# Altium schematic sheet OmniSensor.SchDoc
size A4; SheetNumber: 1; SheetTotal: 1
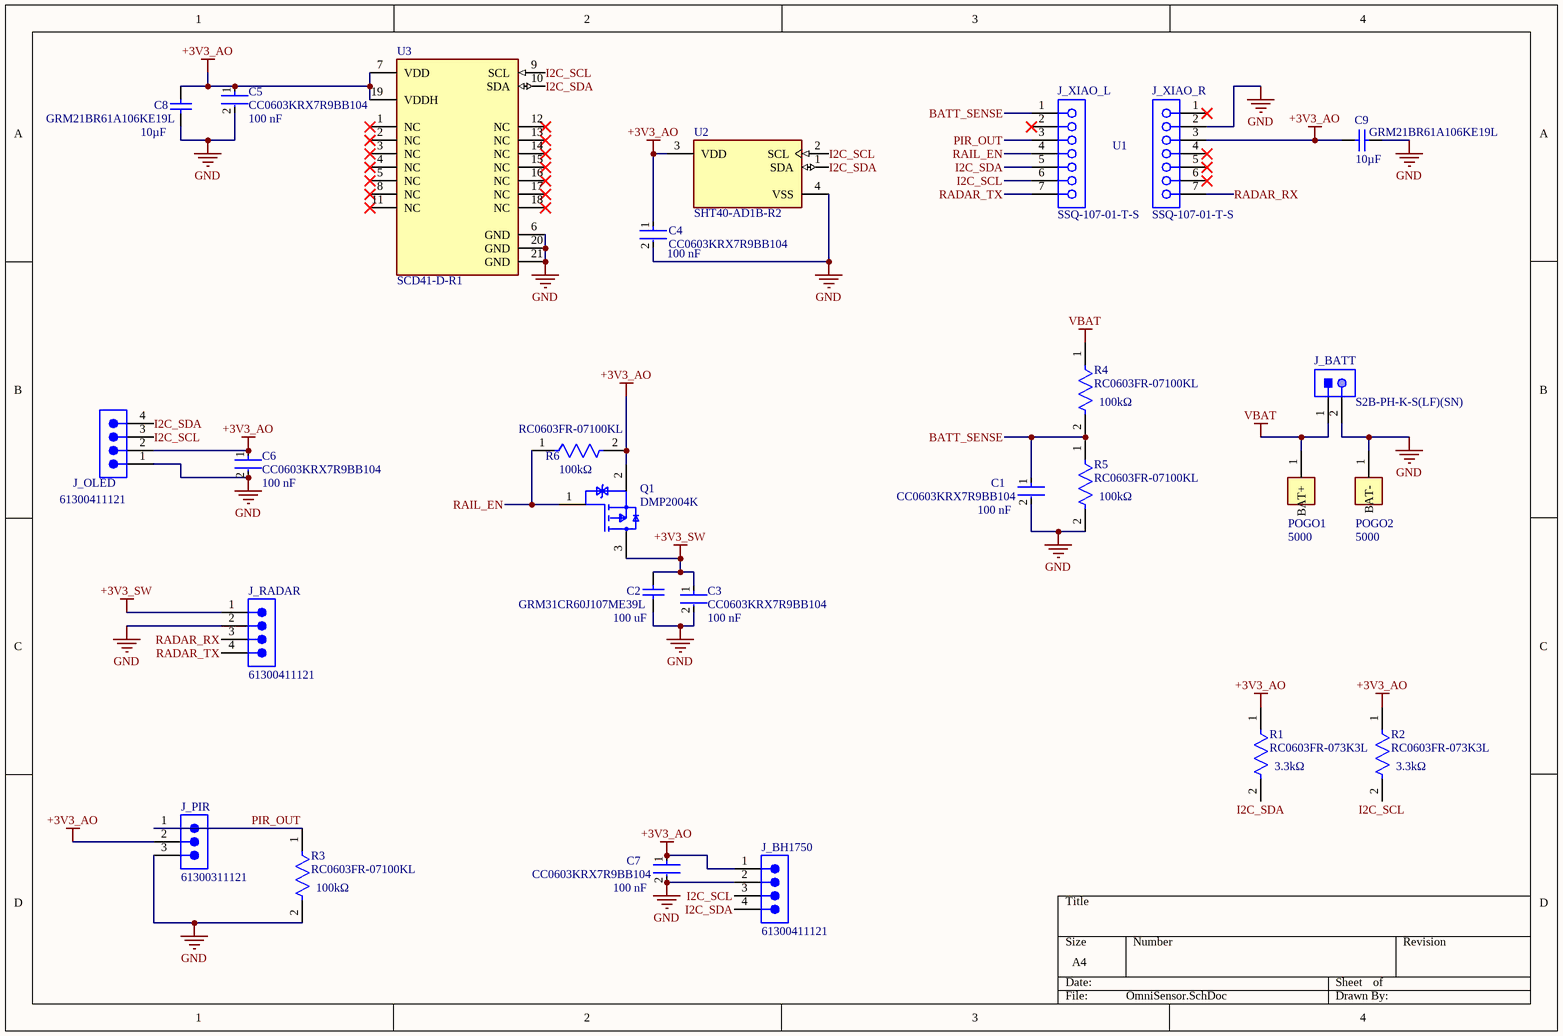
[diagram p0: OmniSensor.SchDoc]

## Parts
C1  CC0603KRX7R9BB104  value 100 nF  [FP-CC0603-DA-MFG]
C2  GRM31CR60J107ME39L  Capacitance: 100 uF  [CAPC3216X190X55ML30T25]
C3  CC0603KRX7R9BB104  value 100 nF  [FP-CC0603-DA-MFG]
C4  CC0603KRX7R9BB104  Capacitance: 100 nF  [FP-CC0603-DA-MFG]
C5  CC0603KRX7R9BB104  Capacitance: 100 nF  [FP-CC0603-DA-MFG]
C6  CC0603KRX7R9BB104  Capacitance: 100 nF  [FP-CC0603-DA-MFG]
C7  CC0603KRX7R9BB104  Capacitance: 100 nF  [FP-CC0603-DA-MFG]
C8  GRM21BR61A106KE19L  Capacitance: 10µF  [MURA-0805_H_1.35_M]
C9  GRM21BR61A106KE19L  Capacitance: 10µF  [MURA-0805_H_1.35_M]
J_BATT  S2B-PH-K-S(LF)(SN)  [JST-S2B-PH-K-S_V]
J_BH1750  61300411121  [61300411121]
J_OLED  61300411121  [61300411121]
J_PIR  61300311121  [61300311121]
J_RADAR  61300411121  [61300411121]
J_XIAO_L  SSQ-107-01-T-S  [SMTC-SSQ-107-01-X-S]
J_XIAO_R  SSQ-107-01-T-S  [SMTC-SSQ-107-01-X-S]
POGO1  5000  [FP-5000-MFG]
POGO2  5000  [FP-5000-MFG]
Q1  DMP2004K  [FP-SOT23-MFG]
R1  RC0603FR-073K3L  Resistance: 3.3kΩ  [FP-RC0603-0_55-MFG]
R2  RC0603FR-073K3L  Resistance: 3.3kΩ  [FP-RC0603-0_55-MFG]
R3  RC0603FR-07100KL  Resistance: 100kΩ  [FP-RC0603-0_55-MFG]
R4  RC0603FR-07100KL  Resistance: 100kΩ  [FP-RC0603-0_55-MFG]
R5  RC0603FR-07100KL  Resistance: 100kΩ  [FP-RC0603-0_55-MFG]
R6  RC0603FR-07100KL  Resistance: 100kΩ  [FP-RC0603-0_55-MFG]
U2  SHT40-AD1B-R2  [FP-SHT40-AD1B-R2-MFG]
U3  SCD41-D-R1  [FP-SCD41-D-R1-MFG]

## Nets
+3V3_AO: C4.1 C5.1 C6.1 C7.1 C8.2 C9.1 J_BH1750.1 J_OLED.2 J_PIR.2 J_XIAO_R.3 Q1.2(S) R1.1 R2.1 R6.2 U2.3(VDD) U3.7(VDD) U3.19(VDDH)
+3V3_SW: C2.2 C3.1 J_RADAR.1 Q1.3(D)
GND: C1.2 C2.1 C3.2 C4.2 C5.2 C6.2 C7.2 C8.1 C9.2 J_BATT.2 J_BH1750.2 J_OLED.1 J_PIR.3 J_RADAR.2 J_XIAO_R.2 POGO2.1(BAT-) R3.2 R5.2 U2.4(VSS) U3.6(GND) U3.20(GND) U3.21(GND)
VBAT: J_BATT.1 POGO1.1(BAT+) R4.1
BATT_SENSE: C1.1 J_XIAO_L.1 R4.2 R5.1
I2C_SCL: J_BH1750.3 J_OLED.3 J_XIAO_L.6 R2.2 U2.2(SCL) U3.9(SCL)
I2C_SDA: J_BH1750.4 J_OLED.4 J_XIAO_L.5 R1.2 U2.1(SDA) U3.10(SDA)
PIR_OUT: J_PIR.1 J_XIAO_L.3 R3.1
RADAR_RX: J_RADAR.3 J_XIAO_R.7
RADAR_TX: J_RADAR.4 J_XIAO_L.7
RAIL_EN: J_XIAO_L.4 Q1.1(G) R6.1

Not connected (* = marked no-connect by the designer): J_XIAO_L 2*; J_XIAO_R 1* 4* 5* 6*; U3 1(NC)* 2(NC)* 3(NC)* 4(NC)* 5(NC)* 8(NC)* 11(NC)* 12(NC)* 13(NC)* 14(NC)* 15(NC)* 16(NC)* 17(NC)* 18(NC)*

## Notes on the sheet
- U1

## Library data of the parts
C1 C3 = CMP-2100-03601-2: CAP CER 0.1UF 50V X7R 0603; Manufacturer: YAGEO; Material: Ceramic; Temperature Coefficient: 15%; Tolerance: 0.1; Description: CC0603 100 nF X7R 10.00% 50 V; Height: 0.9mm; Voltage: 50 V; ComponentLink2Description: Datasheet; Device Class L2: Capacitors; Temperature Range High: +125°C; Category: Cap; Capacitance: 100 nF; Footprint Url: http://www.yageo.com/exep/pages/download/literatures/UPY-C_GEN_24.pdf; ComponentLink2URL: http://www.yageo.com/documents/recent/UPY-GPHC_X7R_6.3V-to-50V_18.pdf; Package: CC0603-DA; Temperature: -55°C to +125°C; Voltage Rating: 50 V; Temperature Characteristic: X7R; Device Class L1: Passive Components; Temperature Range Low: -55°C; Manufacturer Part Number: CC0603KRX7R9BB104; RoHS: TRUE; Automotive: No; Device Class L3: Ceramic Capacitors; Octopart: https://octopart.com/cc0603krx7r9bb104-yageo-42244635; Mouser Description: Multilayer Ceramic Capacitor, CC Series, 0.1 - F, - 10%, X7R, 50 V, 0603 [1608 Metric]; Lead Free: Yes; Digikey Description: CAP CER 0.1UF 50V X7R 0603
C2 = CMP-1662-00011-2: Chip Capacitor, 100 uF, +/- 20%, 6.3 V, -55 to 85 degC, 1206 (3216 Metric), RoHS, Tape and Reel; Case\/Package: 1206; Voltage Rating (DC): 6.3 V; Type (Capacitors): X5R; REACH SVHC: No SVHC; Height: 1.6 mm; Tolerance: 20%; Packaging: Tape and Reel; Mount: Surface Mount; PackageDescription: 2-Pin Surface Mount Device, Body 3.2 x 1.6 mm; ComponentLink1URL: http://www.murata.com/; Pins: 2; ComponentLink2Description: Datasheet; PackageReference: 1206; Width: 1.6 mm; Package Quantity: 2000; Min Operating Temperature: -55 degC; Case Code (Imperial): 1206; Max Operating Temperature: 85 degC; DatasheetVersion: 09/2016; Mounting Technology: Surface Mount; Voltage Rating: 6.3 V; ComponentLink1Description: Manufacturer URL; Radiation Hardening: No; Case Code (Metric): 3216; PartNumber: GRM31CR60J107ME39L; Length: 3.2 mm; ComponentLink2URL: http://psearch.en.murata.com/capacitor/product/GRM31CR60J107ME39%23.pdf; RoHSCompliant: true
C4-C7 = CMP-2100-03601-2: CAP CER 0.1UF 50V X7R 0603; Manufacturer: YAGEO; Material: Ceramic; Temperature Coefficient: 15%; Tolerance: 0.1; Value: 100 nF; Description: CC0603 100 nF X7R 10.00% 50 V; Height: 0.9mm; Voltage: 50 V; ComponentLink2Description: Datasheet; Device Class L2: Capacitors; Temperature Range High: +125°C; Category: Cap; Footprint Url: http://www.yageo.com/exep/pages/download/literatures/UPY-C_GEN_24.pdf; ComponentLink2URL: http://www.yageo.com/documents/recent/UPY-GPHC_X7R_6.3V-to-50V_18.pdf; Package: CC0603-DA; Temperature: -55°C to +125°C; Voltage Rating: 50 V; Temperature Characteristic: X7R; Device Class L1: Passive Components; Temperature Range Low: -55°C; Manufacturer Part Number: CC0603KRX7R9BB104; RoHS: TRUE; Automotive: No; Device Class L3: Ceramic Capacitors; Octopart: https://octopart.com/cc0603krx7r9bb104-yageo-42244635; Mouser Description: Multilayer Ceramic Capacitor, CC Series, 0.1 - F, - 10%, X7R, 50 V, 0603 [1608 Metric]; Lead Free: Yes; Digikey Description: CAP CER 0.1UF 50V X7R 0603
C8 C9 = CMP-2000-05254-1: CAP, Ceramic, 10 uF, 10%, 10 V, 0805, RoHS, Tape and Reel; Manufacturer: Murata; Voltage - Rated: 10V; Product Training Modules: High-CapMultilayerCeramicCapacitors; Catalog Drawings: GRMSeries_0805_1.25; Temperature Coefficient: X5R; Online Catalog: GRMSeries; Featured Product: GA3SafetyRecognizedCapsandHi-CapMLCC; Other Names: 490-1709-6; Applications: GeneralPurpose; Category: Capacitors; Datasheet Version: Aug-14; Datasheet URL: https://datasheet.ciiva.com/3777/210grm21br61a106ke1923-3777175.pdf; Ratings: -; Height - Seated (Max): -; Lead Spacing: -; Operating Temperature: -55degC~85degC; Features: -; Package Description: 2-Pin Surface Mount Device (0805), Body 2.1 x 1.35 mm; Standard Package: 1; Mounting Type: SurfaceMount,MLCC; Package Reference: 805; Tolerance: ±10%; Manufacturer URL: http://www.murata.com/; Size / Dimension: 0.079"Lx0.049"W(2.00mmx1.25mm); Packaging: Digi-Reel; Thickness (Max): 0.053"(1.35mm); Package / Case: 0805(2012Metric); Family: CeramicCapacitors; Series: GRM; Lead Style: -
J_BATT = CMP-1755-00004-1: Male Header, Pitch 2 mm, 1 x 2 Position, Height 4.8 mm, Tail Length 3.4 mm, -25 to 85 degC, RoHS, Bulk; Case\Package: Radial; Tolerance: 20%; Capacitance: 10 uF; Voltage Rating (DC): 50 V; Packaging: Bulk; ComponentLink1URL: http://www.jst-mfg.com/product/pdf/eng/ePH.pdf; Radiation Hardening: No; Height: 11 mm; Package Quantity: 200; PackageDescription: Male Header, Pitch 2 mm, 1 x 2 Position, Height 4.8 mm, Tail Length 3.4 mm; PackageReference: S2B-PH-K-S; Diameter: 5 mm; Pins: 2; Mount: Through Hole; Max Operating Temperature: 85 degC; Min Operating Temperature: -40 degC; ComponentLink1Description: Datasheet; DatasheetVersion: Dec-12; Length: 11 mm; Lead Pitch: 2 mm; REACH SVHC: No SVHC; Voltage Rating: 50 V; RoHSCompliant: true
J_BH1750 J_OLED J_RADAR = CMP-1502-01064-4: THT Vertical Pin Header WR-PHD, Pitch 2.54 mm, Single Row, 4 pins; Connector Type: Male Pin; Gender: Male; Current Rating: 3A; Number of Positions: 4; Operating Supply Voltage: 250V; Contact Resistance: 20mΩ; Pitch: 2.54mm; Max Operating Temperature: 105°C; Mount: Through Hole; Contact Material: Gold; Contact Plating: Gold; Number of Contacts: 4; Orientation: Vertical; Packaging: Bulk; Contact Mating Length: 5.9944mm; Voltage Rating: 250V; Number of Rows: 1; Height: 8.89mm; Lead Free: Lead Free; Lead Pitch: 2.54mm; Number of Pins: 4; Color: Black; Min Operating Temperature: -40°C; RoHS: Compliant; Termination: Solder
J_PIR = CMP-1502-01062-4: THT Vertical Pin Header WR-PHD, Pitch 2.54 mm, Single Row, 3 pins; Connector Type: Male Pin; Number of Contacts: 3; Operating Supply Voltage: 250V; Current Rating: 3A; Pitch: 2.54mm; Contact Resistance: 20mΩ; Gender: Male; Height: 8.94mm; Color: Black; Min Operating Temperature: -40°C; Max Operating Temperature: 105°C; Mount: Through Hole; Termination: Solder; Number of Rows: 1; Packaging: Bulk; Number of Pins: 3; Lead Pitch: 2.54mm; RoHS: Compliant; Contact Plating: Gold; Number of Positions: 3; Lead Free: Lead Free; Voltage Rating: 250V; Contact Mating Length: 5.9944mm; Orientation: Vertical; Contact Material: Gold
J_XIAO_L J_XIAO_R = CMP-1023-00285-1: SQ Post Socket, Through-hole, Vertical, -55 to 105 degC, 2.54 mm Pitch, 7-Pin, Female, RoHS; Manufacturer: Samtec; Pitch: 2.54 mm; Mounting Technology: Through-hole; PackageReference: SSQ-107-01-X-S; PackageDescription: Assembly, Socket Strip .025[0.64] SQ Tail; ComponentLink2Description: Datasheet; PartNumber: SSQ-107-01-T-S; Orientation: Vertical; ComponentLink2URL: http://www.samtec.com/documents/webfiles/pdf/SSQ_TH.PDF; PackageVersion: BD, 6/1987; ComponentLink3URL: http://www.samtec.com/documents/webfiles/cpdf/SSQ-1XX-XX-XXX-X-XX-XXX-XX-X-MKT.pdf; RoHS: True; ComponentLink1Description: Manufacturer URL; ComponentLink1URL: http://www.samtec.com; Temperature Range: -55 to 105 degC; DatasheetVersion: F-214; ComponentLink3Description: Package Specification
POGO1 POGO2 = CMP-19636-000027-1: PC TEST POINT MINIATURE RED; Outside Diameter: 2.54mm; Body Material: Bronze; Number of Contacts: 1; Insulation: Insulated; Inside Diameter: 1.27mm; Hole Diameter: 1.6mm; Plating: Silver; Length: 7.62mm; Package Quantity: 100; Number of Ports: 1; Contact Material: Bronze; Orientation: Straight; RoHS Compliant: Yes; Housing Color: Red; Height: 0.3inch; Series: THM; Lead Free: Lead Free; Color: Red; Contact Plating: Tin; Mount: PCB; Packaging: Bulk; REACH SVHC: No SVHC; Flammability Rating: UL94 V-0; Material: Nylon
Q1 = CMP-12801-000029-1: MOSFET P-CH 20V 600MA SOT23-3; Manufacturer Part Number: DMP2004K-7; Manufacturer: Diodes Inc.; Max Junction Temp: +150°C; Turn On Delay Time: 8.5ns; Gate To Source Voltage: 8V; Input Capacitace At Vds: 175pF @ -16V; Rthja Max: 227°C/W; Drain To Source Resistance: 1.1Ω; Turn Off Delay Time: 20.2ns; Standoff Height: 0.013mm; Drain To Source Breakdown Voltage: -20V; Number Of P Channels: 1; Power Dissipation: 550mW; Pulse Drain Current: -1.9A; Depletion Mode: False; Max Forward Diode Voltage: -1.2V; Threshold Vgs Min: -0.5V; Threshold Vgs Max: -1V; Continuous Drain Current: -600mA; Description: Transistor: P-MOSFET; unipolar; -20V; -0.6A; 0.55W; SOT23; Height: 1.1mm; ComponentLink2Description: Datasheet; ComponentLink2URL: https://www.diodes.com/assets/Datasheets/ds30933.pdf; Package: SOT23; Footprint Url: https://www.diodes.com/assets/Package-Files/SOT23.pdf; Lead Free: Yes; Octopart: https://octopart.com/dmp2004k-7-diodes+inc.-7151877; Digikey Description: MOSFET P-CH 20V 600MA SOT23-3; Device Class L1: Discrete Semiconductors; Drain To Source Voltage: -20V; Mouser Description: MOSFET P-Channel; Number Of Channels: 1; Device Class L3: MOSFETs; Temperature: -55°C to +150°C; Category: Trans; Device Class L2: Transistors; Automotive: No; Temperature Range High: +150°C; RoHS: TRUE; Temperature Range Low: -55°C
R1 R2 = CMP-1012-00567-3: NexarPartId: 40011875; Tolerance: 1%; Power Rating: 100mW; Temperature Coefficient: 100ppm/°C; Voltage Rating (DC): 50V; Military Standard: Not; Case/Package: 0603; Mount: Surface Mount; Lead Free: Lead Free; Packaging: Tape & Reel; Termination: SMD/SMT; Number of Terminations: 2; Composition: Thick Film; Length: 1.6mm; Max Power Dissipation: 100mW; Width: 800µm; Features: Moisture Resistant; Max Operating Temperature: 155°C; Depth: 800µm; Number of Pins: 2; REACH SVHC: No SVHC; Case Code (Imperial): 0603; Case Code (Metric): 0603; RoHS: Compliant; Voltage Rating (AC): 50V; Voltage Rating: 50V; Schedule B: 8533210045, 8533210045; Min Operating Temperature: -55°C; Height: 450µm
R3-R6 = CMP-2100-03662-2: RES SMD 100K OHM 1% 1/10W 0603; Voltage Rating (DC): 50V; Max Power Dissipation: 100mW; Temperature Coefficient: 100ppm/°C; Working Voltage: 75V; Length: 1.6mm; Lead Free: Lead Free; Number of Terminations: 2; Packaging: Tape and Reel; Voltage Rating: 50V; Termination: SMD/SMT; Width: 0.8mm; Resistor Type: Thick Film; Resistance Tolerance: 1%; Features: Moisture Resistant; Height: 0.45mm; Construction: Rectangular; Case/Package: 0603; Military Standard: Not; Case Code (Imperial): 0603; Series: RC; Technology: THICK FILM; Depth: 0.8mm; RoHS Compliant: Yes; REACH SVHC: No SVHC; Min Operating Temperature: -55°C; Case Code (Metric): 1608; Max Operating Temperature: 155°C; Power Rating: 100mW; Number of Pins: 2; Tolerance: 1%
U2 = CMP-144040-000008-1: SENSOR HUMIDITY 100 RH SMD
U3 = CMP-144026-000007-1: CO2 SENSOR 40 PPM I2C SMD